# EAGLE design alimentadorV5 (EAGLE 6.6.0)
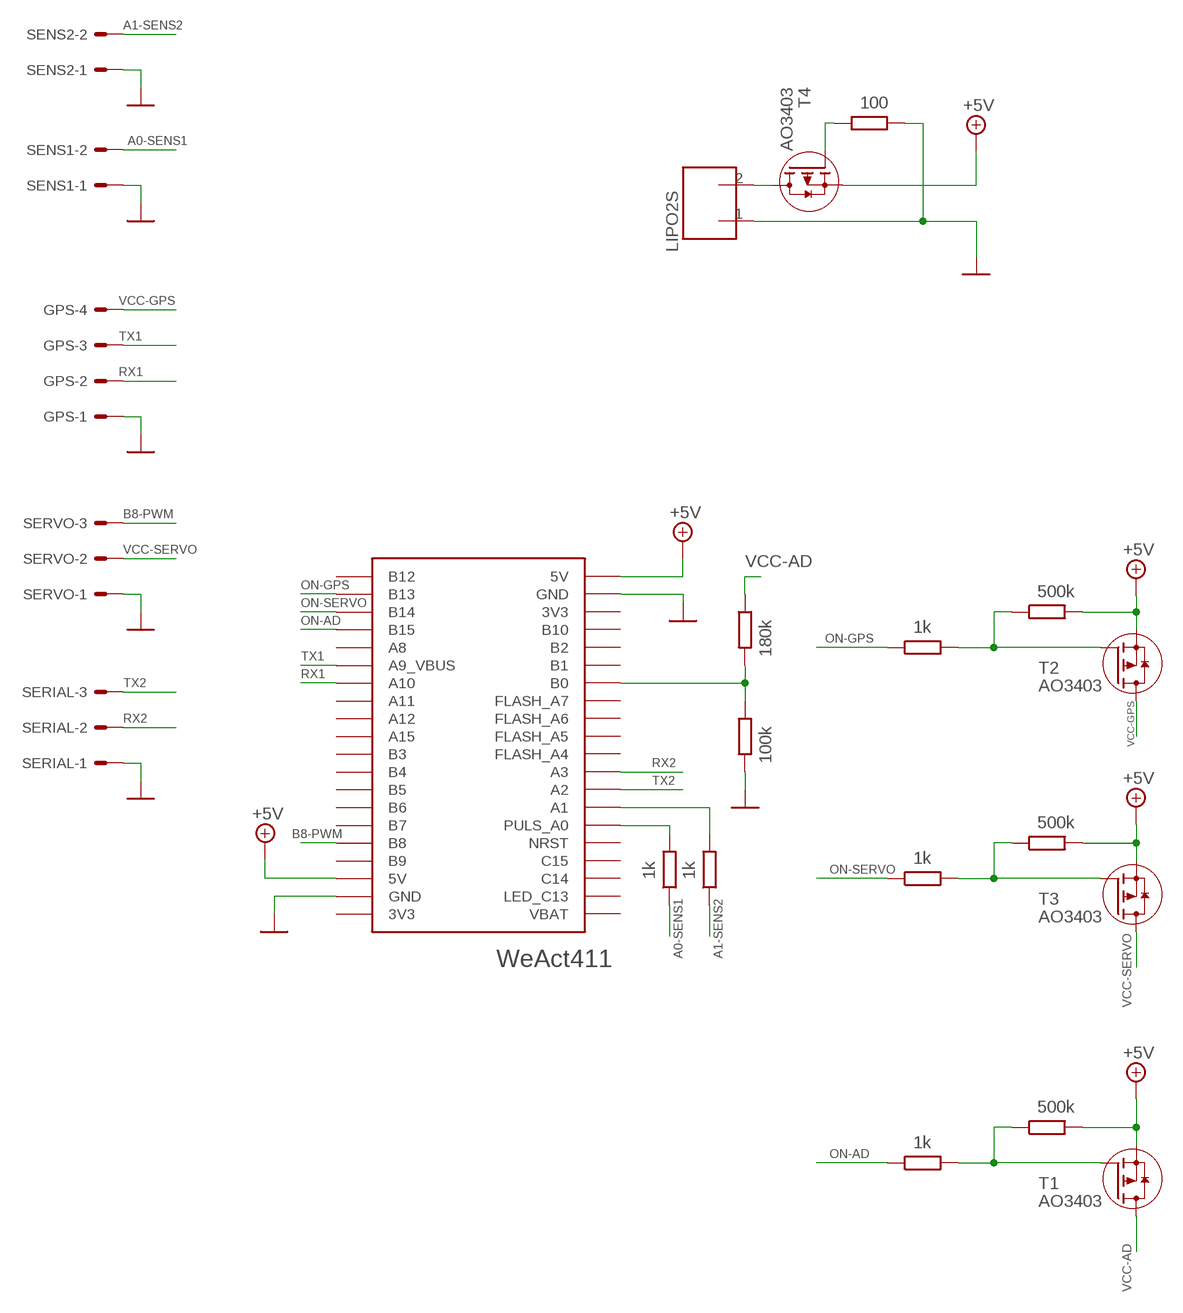
[diagram p0: schematic, sheet 1]

## Parts
GPS  22-27-2041-04  [6410-04]
LIPO2S  CONECTOR_2P-3.81  [CON2P-3.81]
R1  500k  R-EU_R1206  [R1206]
R2  100k  R-EU_R1206  [R1206]
R3  180k  R-EU_R1206  [R1206]
R4  1k  R-EU_R1206  [R1206]
R5  500k  R-EU_R1206  [R1206]
R6  1k  R-EU_R1206  [R1206]
R7  100  R-EU_R1206  [R1206]
R11  500k  R-EU_R1206  [R1206]
R12  1k  R-EU_R1206  [R1206]
R13  1k  R-EU_R1206  [R1206]
R14  1k  R-EU_R1206  [R1206]
SENS1  22-27-2021-02  [6410-02]
SENS2  22-27-2021-02  [6410-02]
SERIAL  22-27-2031-03  [6410-03]
SERVO  22-27-2031-03  [6410-03]
T1  AO3403  [SOT23]
T2  AO3403  [SOT23]
T3  AO3403  [SOT23]
T4  AO3403  [SOT23]
U$2  WEACT411  [WEACT411]

## Nets
+5V: R1.2 R5.2 R11.2 T1.2(S) T2.2(S) T3.2(S) T4.2(S) U$2.5V@1(5V) U$2.5V@2(5V)
A0-SENS1: R13.1 SENS1.2
A1-SENS2: R14.1 SENS2.2
B8-PWM: SERVO.3 U$2.B8
GND [pwr]: GPS.1 LIPO2S.1 R2.2 R7.2 SENS1.1 SENS2.1 SERIAL.1 SERVO.1 U$2.GND@1(GND) U$2.GND@2(GND)
N$1: LIPO2S.2 T4.3(D)
N$2: R2.1 R3.2 U$2.B0
N$3: R7.1 T4.1(G)
N$5: R1.1 R4.2 T2.1(G)
N$6: R11.1 R12.2 T1.1(G)
N$8: R5.1 R6.2 T3.1(G)
N$9: R13.2 U$2.A0(PULS_A0)
N$11: R14.2 U$2.A1
ON-AD: R12.1 U$2.B15
ON-GPS: R4.1 U$2.B13
ON-SERVO: R6.1 U$2.B14
RX1: GPS.2 U$2.A10
RX2: SERIAL.2 U$2.A3
TX1: GPS.3 U$2.A9(A9_VBUS)
TX2: SERIAL.3 U$2.A2
VCC-AD: R3.1 T1.3(D)
VCC-GPS: GPS.4 T2.3(D)
VCC-SERVO: SERVO.2 T3.3(D)
Unconnected: U$2.3V3@1(3V3) U$2.3V3@2(3V3) U$2.A4(FLASH_A4) U$2.A5(FLASH_A5) U$2.A6(FLASH_A6) U$2.A7(FLASH_A7) U$2.A8 U$2.A11 U$2.A12 U$2.A15 U$2.B1 U$2.B2 U$2.B3 U$2.B4 U$2.B5 U$2.B6 U$2.B7 U$2.B9 U$2.B10 U$2.B12 U$2.C13(LED_C13) U$2.C14 U$2.C15 U$2.NRST U$2.VBAT

## Library data of the parts
GPS = con-molex:22-?-04: CONNECTOR wire to board 2.54 mm (.1 inch) pitch header; OC_FARNELL: unknown; OC_NEWARK: unknown
LIPO2S = jcf:CONECTOR_2P-3.81
R1-R7 R11-R14 = rcl:R-EU_: RESISTOR, European symbol
SENS1 SENS2 = con-molex:22-?-02: CONNECTOR wire to board 2.54 mm (.1 inch) pitch header; OC_FARNELL: unknown; OC_NEWARK: unknown
SERIAL SERVO = con-molex:22-?-03: CONNECTOR wire to board 2.54 mm (.1 inch) pitch header; OC_FARNELL: unknown; OC_NEWARK: unknown
T1-T4 = jcf:AO3403: AO3403 P-channel MOSFET 2.6A 30V
U$2 = jcf:WEACT411: WeAct STM32F411

## Net classes
0 default: width 0.241 mm, drill 0.584 mm, clearance 0.241 mm
1 pwr: width 0.25 mm

## Board
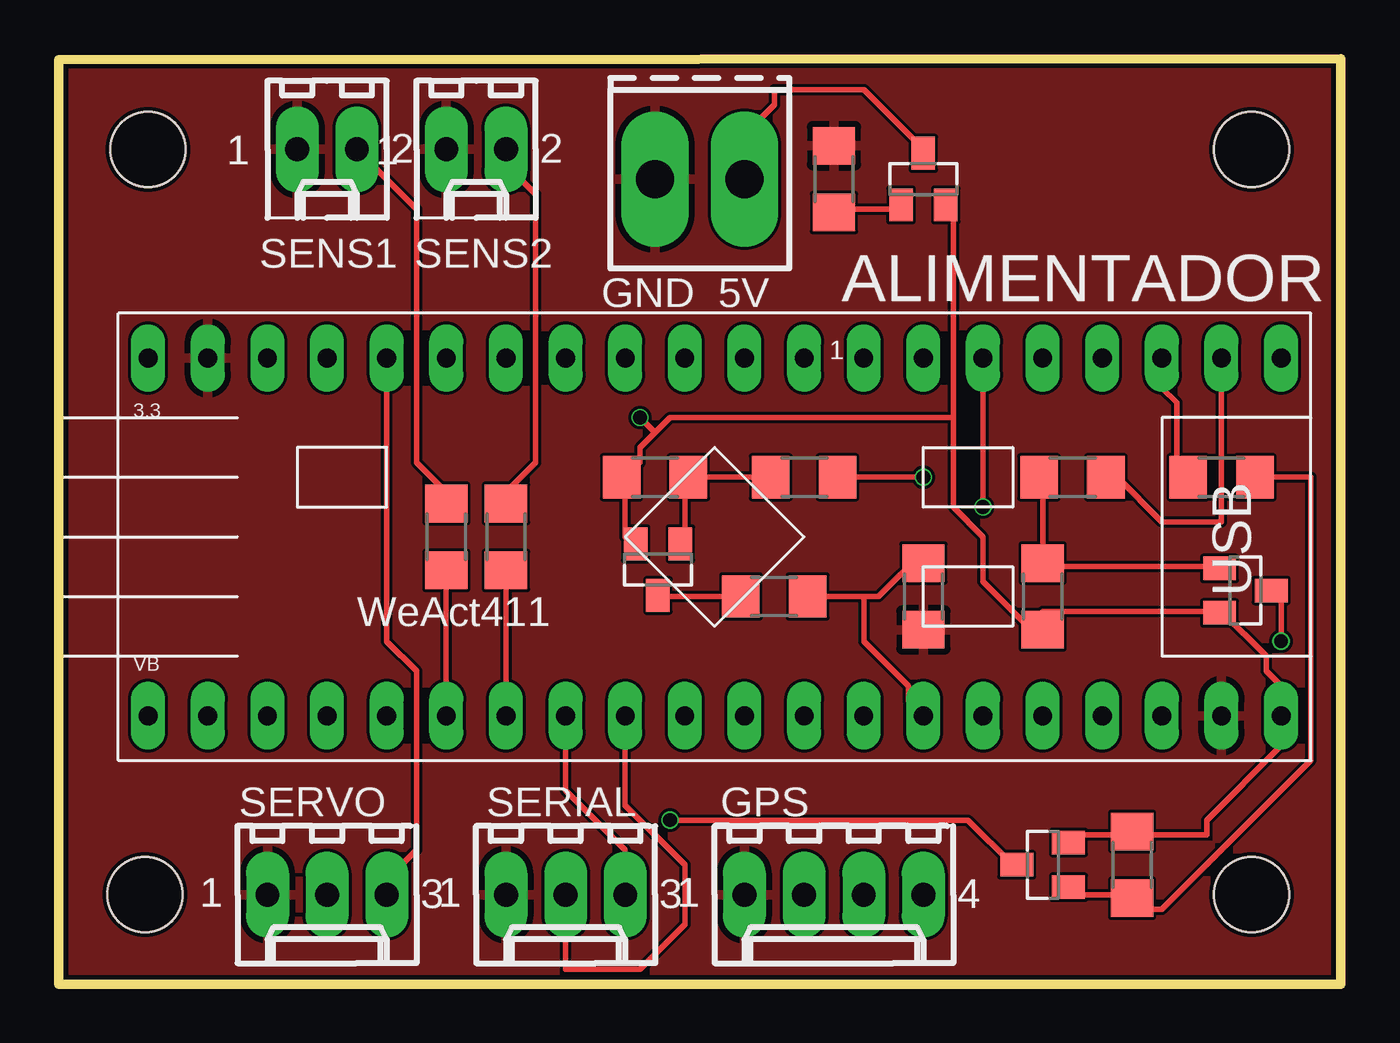
[diagram p1: board, top side]
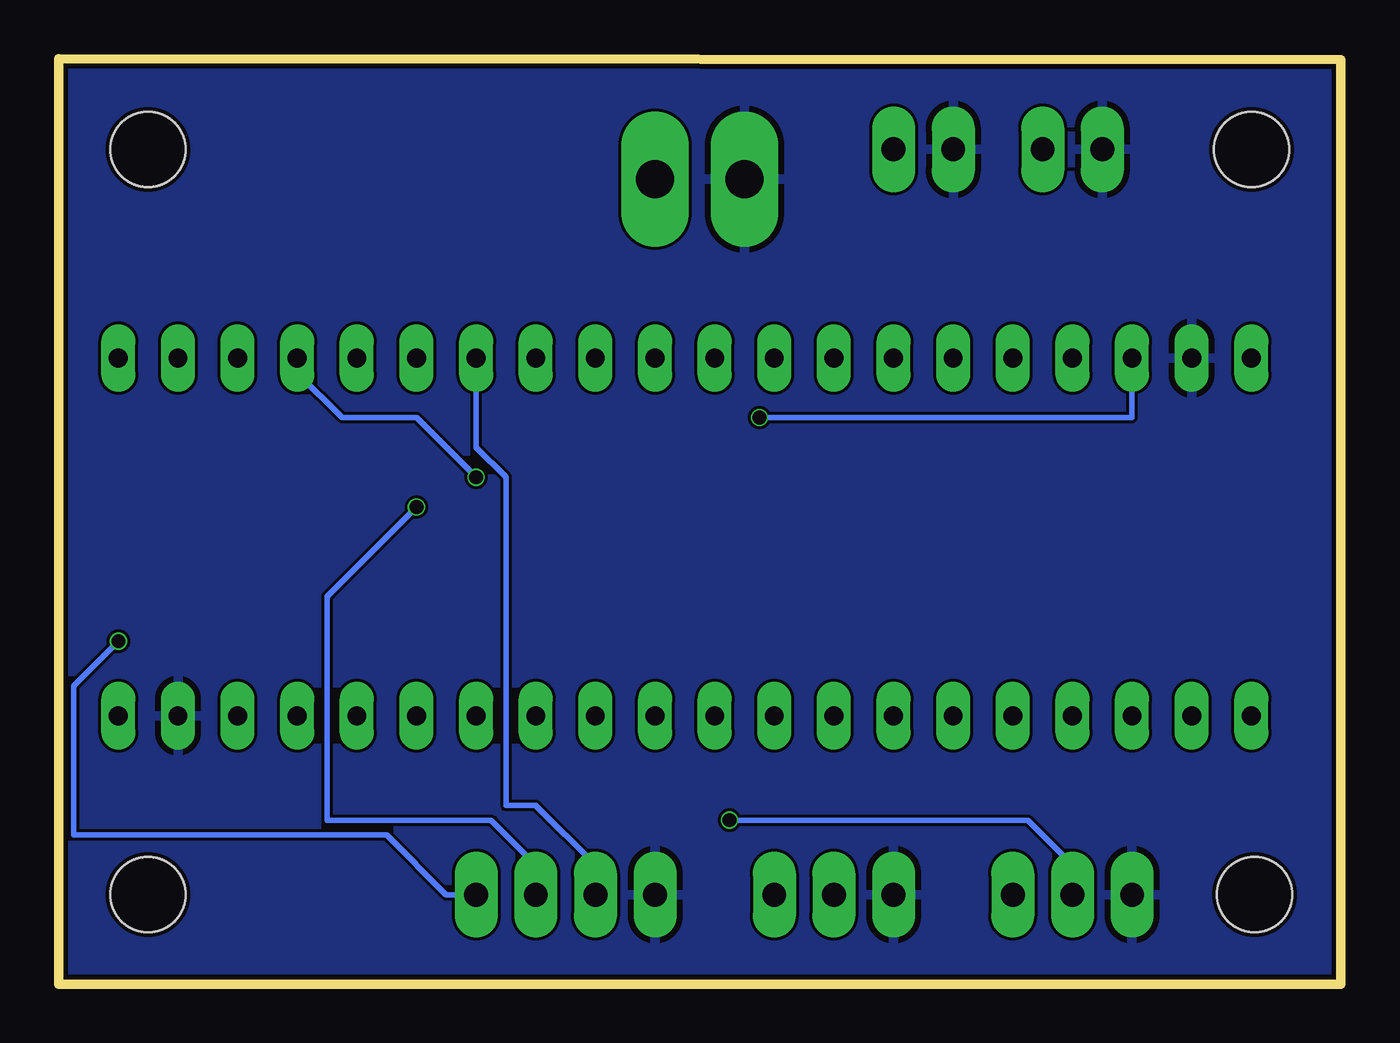
[diagram p2: board, bottom side, seen from below]

Size 54.61 x 39.42 mm. Coordinates in mm from the lower left corner, seen from the top.
Outline: 0,39.37 0,0 54.61,0 54.61,39.42 0,39.37
Copper layers (1*16): Top 0.035mm / dielectric 1.6mm / Bottom 0.035mm
Design rules "jlcpcb-2layers": minimum track width 5mil, minimum drill 0.3mm, track to track 5mil, track to pad 5mil, pad to pad 5mil, via to via 5mil, smd to smd 5mil, copper to edge 0.2mm, drill to drill 6mil, minimum pad ring 10mil, minimum via ring 3mil, stop-mask expansion 4mil, vias tented up to drill 0mil, thermal gap 10mil
Holes 3.2 mm at 50.8,3.81 3.68,3.81 50.8,35.56 3.81,35.56

### Footprints (pad centres in the part's own frame; a part is rotated, then mirrored left to right if it is on the bottom)
6410-04 = drill 1.016 long: 1 3.81,0; 2 1.27,0; 3 -1.27,0; 4 -3.81,0
CON2P-3.81 = drill 1.6 long: 1 0,0; 2 3.81,0
R1206 = smd 1.6 x 1.803: 1 -1.422,0; 2 1.422,0
6410-02 = drill 1.016 long: 1 1.27,0; 2 -1.27,0
6410-03 = drill 1.016 long: 1 2.54,0; 2 0,0; 3 -2.54,0
SOT23 = smd 1 x 1.4: 1 -0.95,-1.1; 2 0.95,-1.1; 3 0,1.1
WEACT411 = drill 0.8 long: 3V3@1 43.18,0; 3V3@2 0,15.24; 5V@1 48.26,0; 5V@2 5.08,15.24; A0 12.7,0; A1 15.24,0; A2 17.78,0; A3 20.32,0; A4 22.86,0; A5 25.4,0; A6 27.94,0; A7 30.48,0; A8 38.1,15.24; A9 35.56,15.24; A10 33.02,15.24; A11 30.48,15.24; A12 27.94,15.24; A15 25.4,15.24; B0 33.02,0; B1 35.56,0; B2 38.1,0; B3 22.86,15.24; B4 20.32,15.24; B5 17.78,15.24; B6 15.24,15.24; B7 12.7,15.24; B8 10.16,15.24; B9 7.62,15.24; B10 40.64,0; B12 48.26,15.24; B13 45.72,15.24; B14 43.18,15.24; B15 40.64,15.24; C13 2.54,0; C14 5.08,0; C15 7.62,0; GND@1 45.72,0; GND@2 2.54,15.24; NRST 10.16,0; VBAT 0,0

### Placement (x,y rotation side)
GPS  33.02,3.81 180 top
LIPO2S  25.4,34.29 0 top
R1  41.91,16.51 270 top
R2  36.83,16.51 270 top
R3  30.48,16.51 0 top
R4  43.18,21.59 180 top
R5  45.72,5.08 90 top
R6  49.53,21.59 0 top
R7  33.02,34.29 90 top
R11  25.4,21.59 180 top
R12  31.75,21.59 180 top
R13  16.51,19.05 270 top
R14  19.05,19.05 270 top
SENS1  11.43,35.56 180 top
SENS2  17.78,35.56 180 top
SERIAL  21.59,3.81 180 top
SERVO  11.43,3.81 180 top
T1  25.53,17.65 180 top
T2  50.55,16.76 270 top
T3  41.91,5.08 90 top
T4  36.83,34.29 0 top
U$2  3.81,11.43 0 top

### Tracks (layer width: path | path; a pad name or v marks a point on that pad's centre or on a via)
+5V  (via drill 0.58)
  Top 0.241: 45.72,6.35 43.18,6.35 T3.2 | 45.72,6.35 48.9,6.35 48.9,6.98 52.07,10.16 U$2.5V@1 52.07,12.7 51.44,13.33 51.44,13.97 49.53,15.87 T2.2 48.9,15.87 41.91,15.87 R1.2 41.91,14.6 39.37,17.14 39.37,19.05 38.1,20.32 38.1,24.13 | 45.72,6.35 R5.2 | 24.13,21.59 24.13,19.05 T1.2 | 38.1,24.13 38.1,33.02 T4.2 | 24.13,21.59 24.77,22.23 24.77,22.86 25.4,23.5 | 25.4,23.5 26.04,24.13 38.1,24.13 | 24.13,21.59 R11.2 | 25.4,23.5 v24.77,24.13
  Bottom 0.241: U$2.5V@2 8.89,24.13 v24.77,24.13
A0-SENS1
  Top 0.241: SENS1.2 15.24,33.02 15.24,22.23 16.51,20.96 R13.1
A1-SENS2
  Top 0.241: SENS2.2 19.05,34.92 20.32,33.66 20.32,22.23 19.05,20.96 R14.1
B8-PWM
  Top 0.241: U$2.B8 13.97,14.6 15.24,13.33 15.24,5.71 13.97,4.45 SERVO.3
GND
  pour Bottom: 0,0 54.61,0 54.61,39.37 0,39.37
  pour Top: 0,39.37 54.61,39.37 54.61,0 0,0
N$1
  Top 0.241: LIPO2S.2 29.21,36.2 30.48,37.46 30.48,38.1 34.29,38.1 36.83,35.56 T4.3
N$2
  Top 0.241: 34.29,16.51 34.93,16.51 36.83,18.42 R2.1 | 34.29,16.51 R3.2 | U$2.B0 36.2,12.06 36.2,12.7 34.29,14.6 34.29,16.51
N$3
  Top 0.241: T4.1 35.56,33.02 33.02,33.02 R7.1
N$5
  Top 0.241: T2.1 48.9,17.78 41.91,17.78 R1.1 41.91,21.59 R4.2
N$6
  Top 0.241: T1.1 26.67,19.05 26.67,21.59 R11.1 R12.2
N$8
  Top 0.241: T3.1 43.18,3.81 45.72,3.81 R5.1 45.72,3.18 46.99,3.18 53.34,9.53 53.34,21.59 R6.2
N$9
  Top 0.241: U$2.A0 R13.2
N$11
  Top 0.241: U$2.A1 R14.2
ON-AD  (via drill 0.58)
  Top 0.241: v36.83,21.59 R12.1
  Bottom 0.241: v36.83,21.59 39.37,24.13 42.55,24.13 44.45,26.04 U$2.B15
ON-GPS
  Top 0.241: U$2.B13 49.53,19.69 46.99,19.69 45.09,21.59 R4.1
ON-SERVO
  Top 0.241: U$2.B14 46.99,25.4 47.62,24.77 47.62,21.59 R6.1
RX1
  Bottom 0.241: U$2.A10 36.83,22.86 35.56,21.59 35.56,7.62 34.29,7.62 31.75,5.08 GPS.2
RX2
  Top 0.241: U$2.A3 24.13,7.62 26.67,5.08 26.67,2.54 24.77,0.64 21.59,0.64 SERIAL.2
TX1  (via drill 0.58)
  Top 0.241: v39.37,20.32 U$2.A9
  Bottom 0.241: v39.37,20.32 43.18,16.51 43.18,6.98 36.2,6.98 34.29,5.08 GPS.3
TX2
  Top 0.241: U$2.A2 21.59,8.25 24.13,5.71 SERIAL.3
VCC-AD
  Top 0.241: R3.1 25.4,16.51 T1.3
VCC-GPS  (via drill 0.58)
  Top 0.241: v52.07,14.6 52.07,16.51 T2.3
  Bottom 0.241: v52.07,14.6 53.98,12.7 53.98,6.35 40.64,6.35 38.1,3.81 GPS.4
VCC-SERVO  (via drill 0.58)
  Top 0.241: v26.04,6.98 38.74,6.98 40.64,5.08 T3.3
  Bottom 0.241: v26.04,6.98 13.33,6.98 11.43,5.08 SERVO.2

### Text on the board
tPlace: GND 5V
tNames: ALIMENTADOR | 1